# Altium schematic sheet SUP_2.5_FMC.SchDoc
size A4; DocumentNumber: 26; SheetNumber: 26; SheetTotal: 30
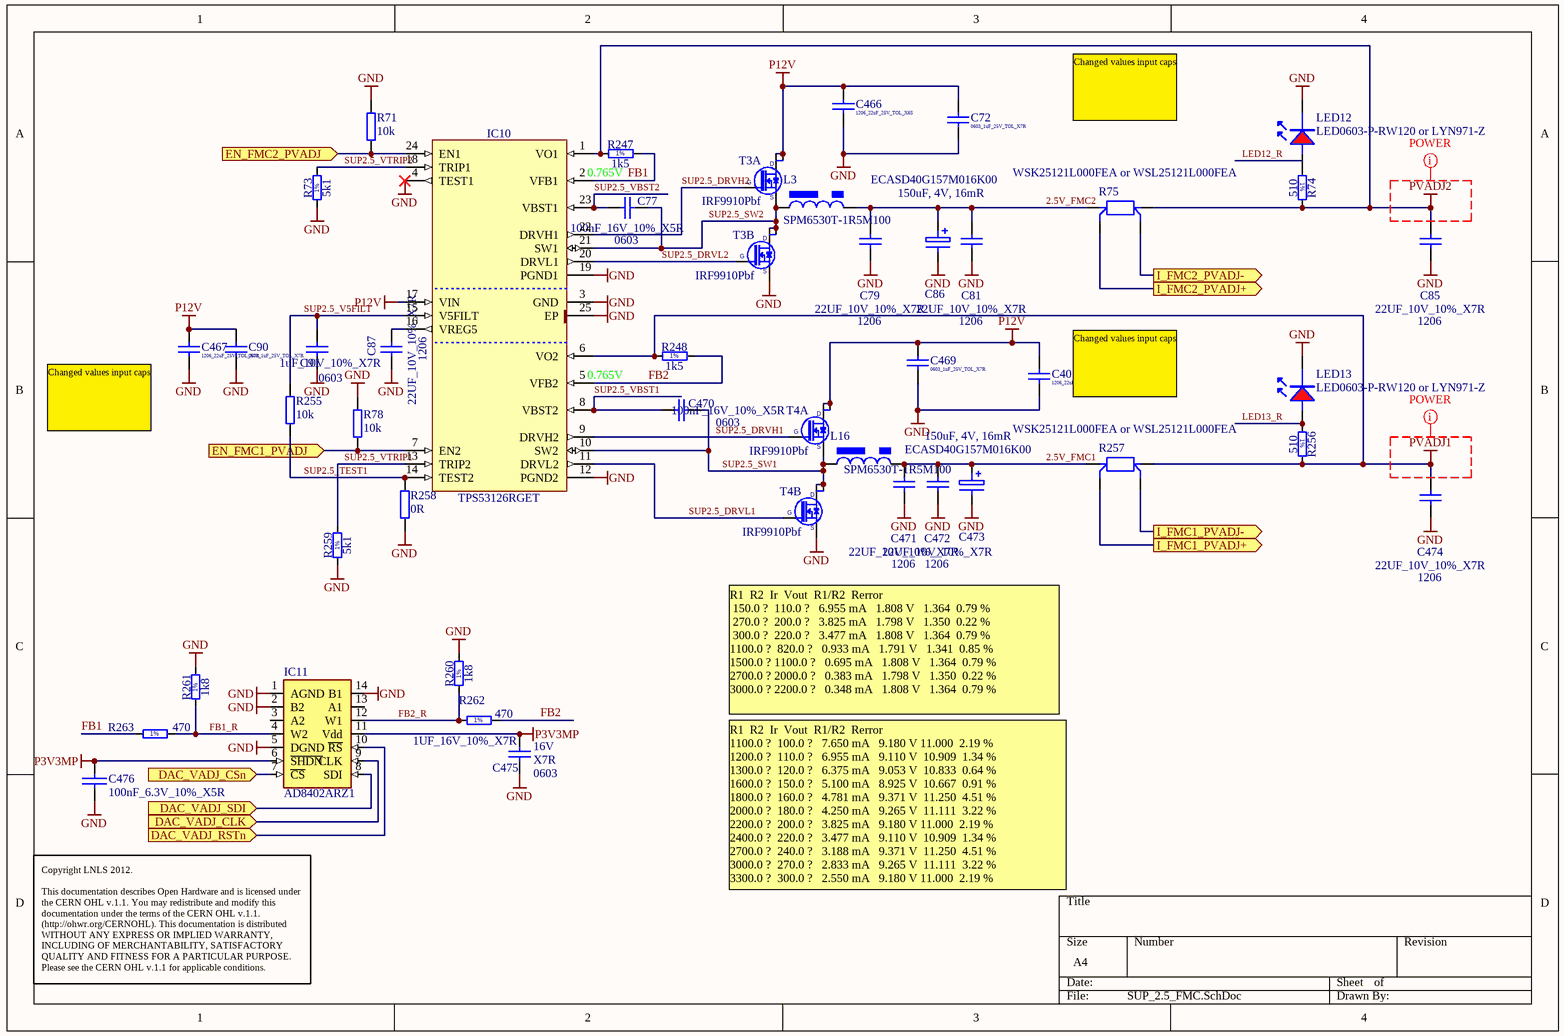
[diagram p0: SUP_2.5_FMC.SchDoc]

## Parts
C40  1206_22uF_25V_TOL_X6S  [CAPC3225X140N]
C72  0603_1uF_25V_TOL_X7R  [CAPC1608X90N]
C77  100nF_16V_10%_X5R  Case: 0603  [0402C]
C79  22UF_10V_10%_X7R  Case: 1206  [1206C]
C81  22UF_10V_10%_X7R  Case: 1206  [1206C]
C85  22UF_10V_10%_X7R  Case: 1206  [1206C]
C86  ECASD40G157M016K00  value 150uF, 4V, 16mR  [2917_POLY]
C87  22UF_10V_10%_X7R  Case: 1206  [1206C]
C90  0603_1uF_25V_TOL_X7R  [CAPC1608X90N]
C91  1uF_10V_10%_X7R  Case: 0603  [0603C]
C466  1206_22uF_25V_TOL_X6S  [CAPC3225X140N]
C467  1206_22uF_25V_TOL_X7R  [CAPC3225X140N]
C469  0603_1uF_25V_TOL_X7R  [CAPC1608X90N]
C470  100nF_16V_10%_X5R  Case: 0603  [0402C]
C471  22UF_10V_10%_X7R  Case: 1206  [1206C]
C472  22UF_10V_10%_X7R  Case: 1206  [1206C]
C473  ECASD40G157M016K00  value 150uF, 4V, 16mR  [2917_POLY]
C474  22UF_10V_10%_X7R  Case: 1206  [1206C]
C475  1UF_16V_10%_X7R  Voltage: 16V  TC: X7R  Case: 0603  [0603C]
C476  100nF_6.3V_10%_X5R  [0201C]
IC10  TPS53126RGET  [QFN50P400X400X100-25N-S255]
IC11  AD8402ARZ1  [SO-14]
L3  SPM6530T-1R5M100  [IND_TDK_SPM6530]
L16  SPM6530T-1R5M100  [IND_TDK_SPM6530]
LED12  LED0603-P-RW120 or LYN971-Z  [led_0603R]
LED13  LED0603-P-RW120 or LYN971-Z  [led_0603R]
R71  10k  [0402R]
R73  5k1  [0603R]
R74  510  [0603R]
R75  WSK25121L000FEA or WSL25121L000FEA  [RES_WSK2512]
R78  10k  [0402R]
R247  1k5  [RESC1608X55N]
R248  1k5  [RESC1608X55N]
R255  10k  [0402R]
R256  510  [0603R]
R257  WSK25121L000FEA or WSL25121L000FEA  [RES_WSK2512]
R258  0R  [0402R]
R259  5k1  [0603R]
R260  1k8  [RESC1608X55N]
R261  1k8  [RESC1608X55N]
R262  470  [RESC1608X55N]
R263  470  [RESC1608X55N]
T3  IRF9910Pbf  [SOIC127P600X175-8N]  (parts A,B of 2)
T4  IRF9910Pbf  [SOIC127P600X175-8N]  (parts A,B of 2)

## Ports
DAC_VADJ_CLK (in), DAC_VADJ_CSn (in), DAC_VADJ_RSTn (in), DAC_VADJ_SDI (in), EN_FMC1_PVADJ (in), EN_FMC2_PVADJ (in), I_FMC1_PVADJ+ (out), I_FMC1_PVADJ- (out), I_FMC2_PVADJ+ (out), I_FMC2_PVADJ- (out)

## Nets
GND: C40.1 C72.1 C79.2 C81.2 C85.2 C86.2 C87.1 C90.1 C91.1 C466.1 C467.1 C469.1 C471.2 C472.2 C473.2 C474.2 C475.1 C476.2 IC10.3(GND) IC10.4(TEST1) IC10.12(PGND2) IC10.19(PGND1) IC10.25(EP) IC11.1(AGND) IC11.2(B2) IC11.5(DGND) IC11.14(B1) LED12.K LED13.K R71.2 R73.1 R78.2 R258.1 R259.1 R260.2 R261.2 T3.1(S) T4.1(S)
P3V3MP: C475.2 C476.1 IC11.6(~{SHDN}) IC11.11(Vdd)
P12V: C40.2 C72.2 C90.2 C466.2 C467.2 C469.2 IC10.17(VIN) T3.5(D) T3.6(D) T4.5(D) T4.6(D)
PVADJ1: C474.1 IC10.6(VO2) R248.1 R256.2 R257.2
PVADJ2: C85.1 IC10.1(VO1) R74.2 R75.2 R247.1
2.5V_FMC1: C471.1 C472.1 C473.1 L16.2 R257.1
2.5V_FMC2: C79.1 C81.1 C86.1 L3.2 R75.1
DAC_VADJ_CLK: IC11.9(CLK) ; port DAC_VADJ_CLK
DAC_VADJ_CSn: IC11.7(~{CS}) ; port DAC_VADJ_CSn
DAC_VADJ_RSTn: IC11.10(~{RS}) ; port DAC_VADJ_RSTn
DAC_VADJ_SDI: IC11.8(SDI) ; port DAC_VADJ_SDI
EN_FMC1_PVADJ: IC10.7(EN2) R78.1 ; port EN_FMC1_PVADJ
EN_FMC2_PVADJ: IC10.24(EN1) R71.1 ; port EN_FMC2_PVADJ
FB1: IC10.2(VFB1) R247.2 R263.1
FB1_R: IC11.4(W2) R261.1 R263.2
FB2: IC10.5(VFB2) R248.2 R262.2
FB2_R: IC11.12(W1) R260.1 R262.1
I_FMC1_PVADJ+: R257.1a ; port I_FMC1_PVADJ+
I_FMC1_PVADJ-: R257.2a ; port I_FMC1_PVADJ-
I_FMC2_PVADJ+: R75.1a ; port I_FMC2_PVADJ+
I_FMC2_PVADJ-: R75.2a ; port I_FMC2_PVADJ-
LED13_R: LED13.A R256.1
SUP2.5_DRVH1: IC10.9(DRVH2) T4.4(G)
SUP2.5_DRVH2: IC10.22(DRVH1) T3.4(G)
SUP2.5_DRVL1: IC10.11(DRVL2) T4.2(G)
SUP2.5_DRVL2: IC10.20(DRVL1) T3.2(G)
SUP2.5_SW1: C470.1 IC10.10(SW2) L16.1 T4.3(S) T4.7(D) T4.8(D)
SUP2.5_SW2: C77.1 IC10.21(SW1) L3.1 T3.3(S) T3.7(D) T3.8(D)
SUP2.5_TEST1: IC10.14(TEST2) R255.1 R258.2
SUP2.5_V5FILT: C91.2 IC10.15(V5FILT) R255.2
SUP2.5_VBST1: C470.2 IC10.8(VBST2)
SUP2.5_VBST2: C77.2 IC10.23(VBST1)
SUP2.5_VTRIP1: IC10.13(TRIP2) R259.2
SUP2.5_VTRIP2: IC10.18(TRIP1) R73.2
NetC87_2: C87.2 IC10.16(VREG5)
NetLED12_A: LED12.A R74.1

Not connected (* = marked no-connect by the designer): IC11 3(A2) 13(A1)

## Layout directives
net class POWER: PVADJ1, PVADJ2

## Notes on the sheet
- Changed values input caps
- 0.765V
- (near IC10) 0.765V
- (near C467) Changed values input caps
- (near C40) Changed values input caps
- R1 	R2 	Ir 	Vout 	R1/R2 	Rerror
  150.0 ?	 110.0 ?	  6.955 mA	  1.808 V	  1.364	 0.79 %
  270.0 ?	 200.0 ?	  3.825 mA	  1.798 V	  1.350	 0.22 %
  300.0 ?	 220.0 ?	  3.477 mA	  1.808 V	  1.364	 0.79 %
  1100.0 ?	 820.0 ?	  0.933 mA	  1.791 V	  1.341	 0.85 %
  1500.0 ?	1100.0 ?	  0.695 mA	  1.808 V	  1.364	 0.79 %
  2700.0 ?	2000.0 ?	  0.383 mA	  1.798 V	  1.350	 0.22 %
  3000.0 ?	2200.0 ?	  0.348 mA	  1.808 V	  1.364	 0.79 %
- R1 	R2 	Ir 	Vout 	R1/R2 	Rerror
  1100.0 ?	 100.0 ?	  7.650 mA	  9.180 V	11.000	 2.19 %
  1200.0 ?	 110.0 ?	  6.955 mA	  9.110 V	 10.909	 1.34 %
  1300.0 ?	 120.0 ?	  6.375 mA	  9.053 V	 10.833	 0.64 %
  1600.0 ?	 150.0 ?	  5.100 mA	  8.925 V	 10.667	 0.91 %
  1800.0 ?	 160.0 ?	  4.781 mA	  9.371 V	 11.250	 4.51 %
  2000.0 ?	 180.0 ?	  4.250 mA	  9.265 V	 11.111	 3.22 %
  2200.0 ?	 200.0 ?	  3.825 mA	  9.180 V	11.000	 2.19 %
  2400.0 ?	 220.0 ?	  3.477 mA	  9.110 V	 10.909	 1.34 %
  2700.0 ?	 240.0 ?	  3.188 mA	  9.371 V	 11.250	 4.51 %
  3000.0 ?	 270.0 ?	  2.833 mA	  9.265 V	 11.111	 3.22 %
  3300.0 ?	 300.0 ?	  2.550 mA	  9.180 V	11.000	 2.19 %
- Copyright LNLS 2012.
  This documentation describes Open Hardware and is licensed under the CERN OHL v.1.1. You may redistribute and modify this documentation under the terms of the CERN OHL v.1.1. (http://ohwr.org/CERNOHL). This documentation is distributed WITHOUT ANY EXPRESS OR IMPLIED WARRANTY, INCLUDING OF MERCHANTABILITY, SATISFACTORY QUALITY AND FITNESS FOR A PARTICULAR PURPOSE. Please see the CERN OHL v.1.1 for applicable conditions.
- (in symbol R0402_510R_1%_0.0625W_100PPM) 1%
- (in symbol R0603_1K5_1%_0.1W_100PPM) 1%
- (in symbol R0603_5K1_1%_0.1W_100PPM) 1%
- (in symbol R0603_470R_1%_0.1W_100PPM) 1%
- (in symbol R0603_910R_1%_0.1W_100PPM) 1%

## Library data of the parts
C40 C466 C467 = Ceramic_1206: MiscInfo: Biggest Cern Footprint [max height]; Document Name: SUP_2.5_FMC.SchDoc; Part Number: Ceramic_1206; FootprintSizeX (mm): 4.65; FootprintSizeY (mm): 2.3; FootprintRectangleArea (mm): 10.7; Thickness (Max) (mm): 1.8; FootprintAlias: 1206
C72 C90 C469 = Ceramic_0603: MiscInfo: Biggest Cern Footprint [max height]; Document Name: SUP_2.5_FMC.SchDoc; Part Number: Ceramic_0603; FootprintSizeX (mm): 3; FootprintSizeY (mm): 1.5; FootprintRectangleArea (mm): 4.5; Thickness (Max) (mm): 0.9; FootprintAlias: 0603
C77 C470 = CC0603_100NF_50V_10%_X7R: Non-polarised capacitor; Part Description: SMD Multilayer Chip Ceramic Capacitor; Manufacturer: GENERIC; Manufacturer1 Part Number: 223858615649; Value: 100nF; Voltage: 50V; TC: X7R; Tolerance: ±10%; Table: Capacitors SMD; Part Number: CC0603_100NF_50V_10%_X7R; Component Kind: Standard; Component Type: Standard; Footprint: CAPC1608X87N; Pin Count: 2; Status: Preferred; Manufacturer Part Number: CC0603_100NF_50V_10%_X7R; Mounted: Yes; Socket: No; SMD: Yes; Manufacturer1 Example: PHYCOMP; Manufacturer1 ComponentHeight: 0.87mm; HelpURL: \\cern.ch\dfs\Applications\Altium\Datasheets\CC0603_X7R_PHYCOMP.pdf; Author: CERN DEM JLC; CreateDate: 2007-12-03; LatestRevisionDate: 2007-12-03
C79 C81 C85 C87 C471 C472 C474 = CC1206_22UF_10V_10%_X7R: Non-polarised capacitor; Part Description: SMD Multilayer Chip Ceramic Capacitor; Manufacturer: GENERIC; Manufacturer1 Part Number: GRM31CR71A226KE15L; Value: 22uF; Voltage: 10V; TC: X7R; Tolerance: ±10%; Table: Capacitors SMD; Part Number: CC1206_22UF_10V_10%_X7R; Component Kind: Standard; Component Type: Standard; Footprint: CAPC3216X180N; Pin Count: 2; Status: Preferred; Manufacturer Part Number: CC1206_22UF_10V_10%_X7R; Mounted: Yes; Socket: No; SMD: Yes; Manufacturer1 Example: MURATA; Manufacturer1 ComponentHeight: 1.8mm; HelpURL: \\cern.ch\dfs\Applications\Altium\Datasheets\CC1206_X7R_MURATA_GRM-HI-CAP.pdf; Author: CERN DEM JLC; CreateDate: 08/06/2010; LatestRevisionDate: 08/06/2010
C86 C473 = CAP_POLYMER_SMDD: POLY, 150uF, 4V, ESR: 16mR
C91 = CC0603_1UF_16V_10%_X7R: Non-polarised capacitor; Part Description: SMD Multilayer Chip Ceramic Capacitor; Manufacturer: GENERIC; Manufacturer1 Part Number: 223824613663; Value: 1uF; Voltage: 16V; TC: X7R; Tolerance: ±10%; Table: Capacitors SMD; Part Number: CC0603_1UF_16V_10%_X7R; Component Kind: Standard; Component Type: Standard; Footprint: CAPC1608X87N; Pin Count: 2; Status: Preferred; Manufacturer Part Number: CC0603_1uF_16V_10%_X7R; Mounted: Yes; Socket: No; SMD: Yes; Manufacturer1 Example: PHYCOMP; Manufacturer1 ComponentHeight: 0.87mm; HelpURL: \\cern.ch\dfs\Applications\Altium\Datasheets\CC0805_X5R_PHYCOMP_HC.pdf; Author: CERN DEM JLC; CreateDate: 03/12/2007; LatestRevisionDate: 03/12/2007
C475 = CC0603_1UF_16V_10%_X7R: Non-polarised capacitor; Part Description: SMD Multilayer Chip Ceramic Capacitor; Manufacturer: GENERIC; Manufacturer1 Part Number: 223824613663; Value: 1uF; Tolerance: ±10%; Table: Capacitors SMD; Part Number: CC0603_1UF_16V_10%_X7R; Component Kind: Standard; Component Type: Standard; Footprint: CAPC1608X87N; Pin Count: 2; Status: Preferred; Manufacturer Part Number: CC0603_1uF_16V_10%_X7R; Mounted: Yes; Socket: No; SMD: Yes; Manufacturer1 Example: PHYCOMP; Manufacturer1 ComponentHeight: 0.87mm; HelpURL: \\cern.ch\dfs\Applications\Altium\Datasheets\CC0805_X5R_PHYCOMP_HC.pdf; Author: CERN DEM JLC; CreateDate: 12/3/2007; LatestRevisionDate: 12/3/2007
C476 = CAP_SMD_0201: Capacitor SMD
IC10 = TPS53126RGET: Dual Synchronous Step-Down Controller For Low Voltage Power Rails; Manufacturer: TEXAS INSTRUMENTS; Table: Analog & Interface; Part Number: TPS53126RGET; Component Kind: Standard; Component Type: Standard; Device: TPS53126RGET; PackageDescription: QFN,0.50mm pitch,square;6 pin X 6 pin,4.15mm X 4.15mm X 1.00mm H body (w/thermal tab 2.55 X 2.55mm),  IPC Medium Density; Part Description: Dual Synchronous Step-Down Controller For Low Voltage Power Rails; Manufacturer Part Number: TPS53126RGET; Pin Count: 25; Case: QFN24; Mounted: Yes; Socket: No; SMD: Yes; ComponentHeight: 1.0mm; Author: CERN DEM JLC; HelpURL: \\cern.ch\dfs\Applications\Altium\Datasheets\TPS53126RGET.pdf; CreateDate: 2010-08-26; LatestRevisionDate: 2010-08-26
IC11 = DAC_AD8402: 1k dual digital potentiometer; Supplier 1: Digi-Key; Supplier Part Number 1: AD8402ARZ100-ND
L3 L16 = L_POWER_SPM6530T: 1.5uH, 20%, 10mR, 11.5A; Supplier 1: Arrow; Supplier Part Number 1: 51419938S48550N1165
LED12 LED13 = LED_0603R: LED 0603 red; Supplier 1: Newark; Supplier Part Number 1: 22M3004; Supplier 2: Newark; Supplier Part Number 2: 20M0618
R71 R78 R255 R258 = RES_0402: SMD Resistor; Supplier 1: Newark; Supplier Part Number 1: 59M6691
R73 R259 = R0603_5K1_1%_0.1W_100PPM: Resistor - 1%; Part Description: General Purpose Thick Film Chip Resistor; Manufacturer: GENERIC; Manufacturer1 Part Number: NRC06F5101TRF; Power: 0.1W; TC: ±100ppm/°C; Table: Resistors SMD; Part Number: R0603_5K1_1%_0.1W_100PPM; Component Kind: Standard; Component Type: Standard; Footprint: RESC1608X55N; Pin Count: 2; Value: 5k1; Status: Preferred; Tolerance: ±1%; Manufacturer Part Number: R0603_5K1_1%_0.1W_100PPM; Case: 0603; Mounted: Yes; Socket: No; SMD: Yes; Manufacturer1 Example: NIC COMPONENT; Manufacturer1 ComponentHeight: 0.55mm; HelpURL: \\cern.ch\dfs\Applications\Altium\Datasheets\R0603_NIC_NRC.pdf; Author: CERN DEM JLC; CreateDate: 2007-12-03; LatestRevisionDate: 2008-03-13
R74 R256 = R0402_510R_1%_0.0625W_100PPM: Resistor - 1%; Part Description: General Purpose Thick Film Chip Resistor; Manufacturer: GENERIC; Manufacturer1 Part Number: 232270675101; TC: ±100ppm/°C; Table: Resistors SMD; Part Number: R0402_510R_1%_0.0625W_100PPM; Component Kind: Standard; Component Type: Standard; Footprint: RESC1005X40N; Pin Count: 2; Value: 510; Status: Not recommended; Power: 0.0625W; Tolerance: ±1%; Manufacturer Part Number: R0402_510R_1%_0.0625W_100PPM; Case: 0402; Mounted: Yes; Socket: No; SMD: Yes; Manufacturer1 Example: PHYCOMP; Manufacturer1 ComponentHeight: 0.4mm; HelpURL: \\cern.ch\dfs\Applications\Altium\Datasheets\R0402_Phycomp_RC0402.pdf; Author: CERN DEM JLC; CreateDate: 2007-12-03; LatestRevisionDate: 2008-03-13
R75 R257 = RES_POW_Kelvin: RESISTOR, METAL STRIP, 0.001 OHM 1%
R247 R248 = R0603_1K5_1%_0.1W_100PPM: Resistor - 1%; Part Description: General Purpose Thick Film Chip Resistor; Manufacturer: GENERIC; Manufacturer1 Part Number: NRC06F1501TRF; Power: 0.1W; TC: ±100ppm/°C; Table: Resistors SMD; Part Number: R0603_1K5_1%_0.1W_100PPM; Component Kind: Standard; Component Type: Standard; Pin Count: 2; Value: 1k5; Status: Preferred; Tolerance: ±1%; Manufacturer Part Number: R0603_1K5_1%_0.1W_100PPM; Case: 0603; Mounted: Yes; Socket: No; SMD: Yes; Manufacturer1 Example: NIC COMPONENT; Manufacturer1 ComponentHeight: 0.55mm; HelpURL: \\cern.ch\dfs\Applications\Altium\Datasheets\R0603_NIC_NRC.pdf; Author: CERN DEM JLC; CreateDate: 2007-12-03; LatestRevisionDate: 2008-03-13
R260 R261 = R0603_910R_1%_0.1W_100PPM: Resistor - 1%; Part Description: General Purpose Thick Film Chip Resistor; Manufacturer: GENERIC; Manufacturer1 Part Number: NRC06F9100TRF; Value: 910; Power: 0.1W; TC: ±100ppm/°C; Table: Resistors SMD; Part Number: R0603_910R_1%_0.1W_100PPM; Component Kind: Standard; Component Type: Standard; Pin Count: 2; Status: Preferred; Tolerance: ±1%; Manufacturer Part Number: R0603_910R_1%_0.1W_100PPM; Case: 0603; Mounted: Yes; Socket: No; SMD: Yes; Manufacturer1 Example: NIC COMPONENT; Manufacturer1 ComponentHeight: 0.55mm; HelpURL: \\cern.ch\dfs\Applications\Altium\Datasheets\R0603_NIC_NRC.pdf; Author: CERN DEM JLC; CreateDate: 2007-12-03; LatestRevisionDate: 2008-03-13
R262 R263 = R0603_470R_1%_0.1W_100PPM: Resistor - 1%; Part Description: General Purpose Thick Film Chip Resistor; Manufacturer: GENERIC; Manufacturer1 Part Number: NRC06F4700TRF; Power: 0.1W; TC: ±100ppm/°C; Table: Resistors SMD; Part Number: R0603_470R_1%_0.1W_100PPM; Component Kind: Standard; Component Type: Standard; Pin Count: 2; Value: 470; Status: Preferred; Tolerance: ±1%; Manufacturer Part Number: R0603_470R_1%_0.1W_100PPM; Case: 0603; Mounted: Yes; Socket: No; SMD: Yes; Manufacturer1 Example: NIC COMPONENT; Manufacturer1 ComponentHeight: 0.55mm; HelpURL: \\cern.ch\dfs\Applications\Altium\Datasheets\R0603_NIC_NRC.pdf; Author: CERN DEM JLC; CreateDate: 2007-12-03; LatestRevisionDate: 2008-03-13
T3 T4 = IRF9910Pbf: Dual SO-8 MOSFET For POL Cconverter; Part Description: 20V 10A(Q1) 20V 12A (Q2) Dual SO-8 MOSFET For POL Cconverter; Manufacturer: INTERNATIONAL RECTIFIER; Table: Transistors; Part Number: IRF9910Pbf; Component Kind: Standard; Component Type: Standard; Device: IRF9910Pbf; PackageDescription: SOIC 8, Pitch 1.27mm - Body 4x5mm, IPC Medium Density; Manufacturer Part Number: IRF9910Pbf; Pin Count: 8; Case: DO8; Mounted: Yes; Socket: No; SMD: Yes; ComponentHeight: 1.75mm; HelpURL: \\cern.ch\dfs\Applications\Altium\Datasheets\IRF9910Pbf.pdf; Author: CERN DEM JLC; CreateDate: 2010-08-30; LatestRevisionDate: 2010-08-30